# EAGLE design PosilaciSystemy (EAGLE 5.06)
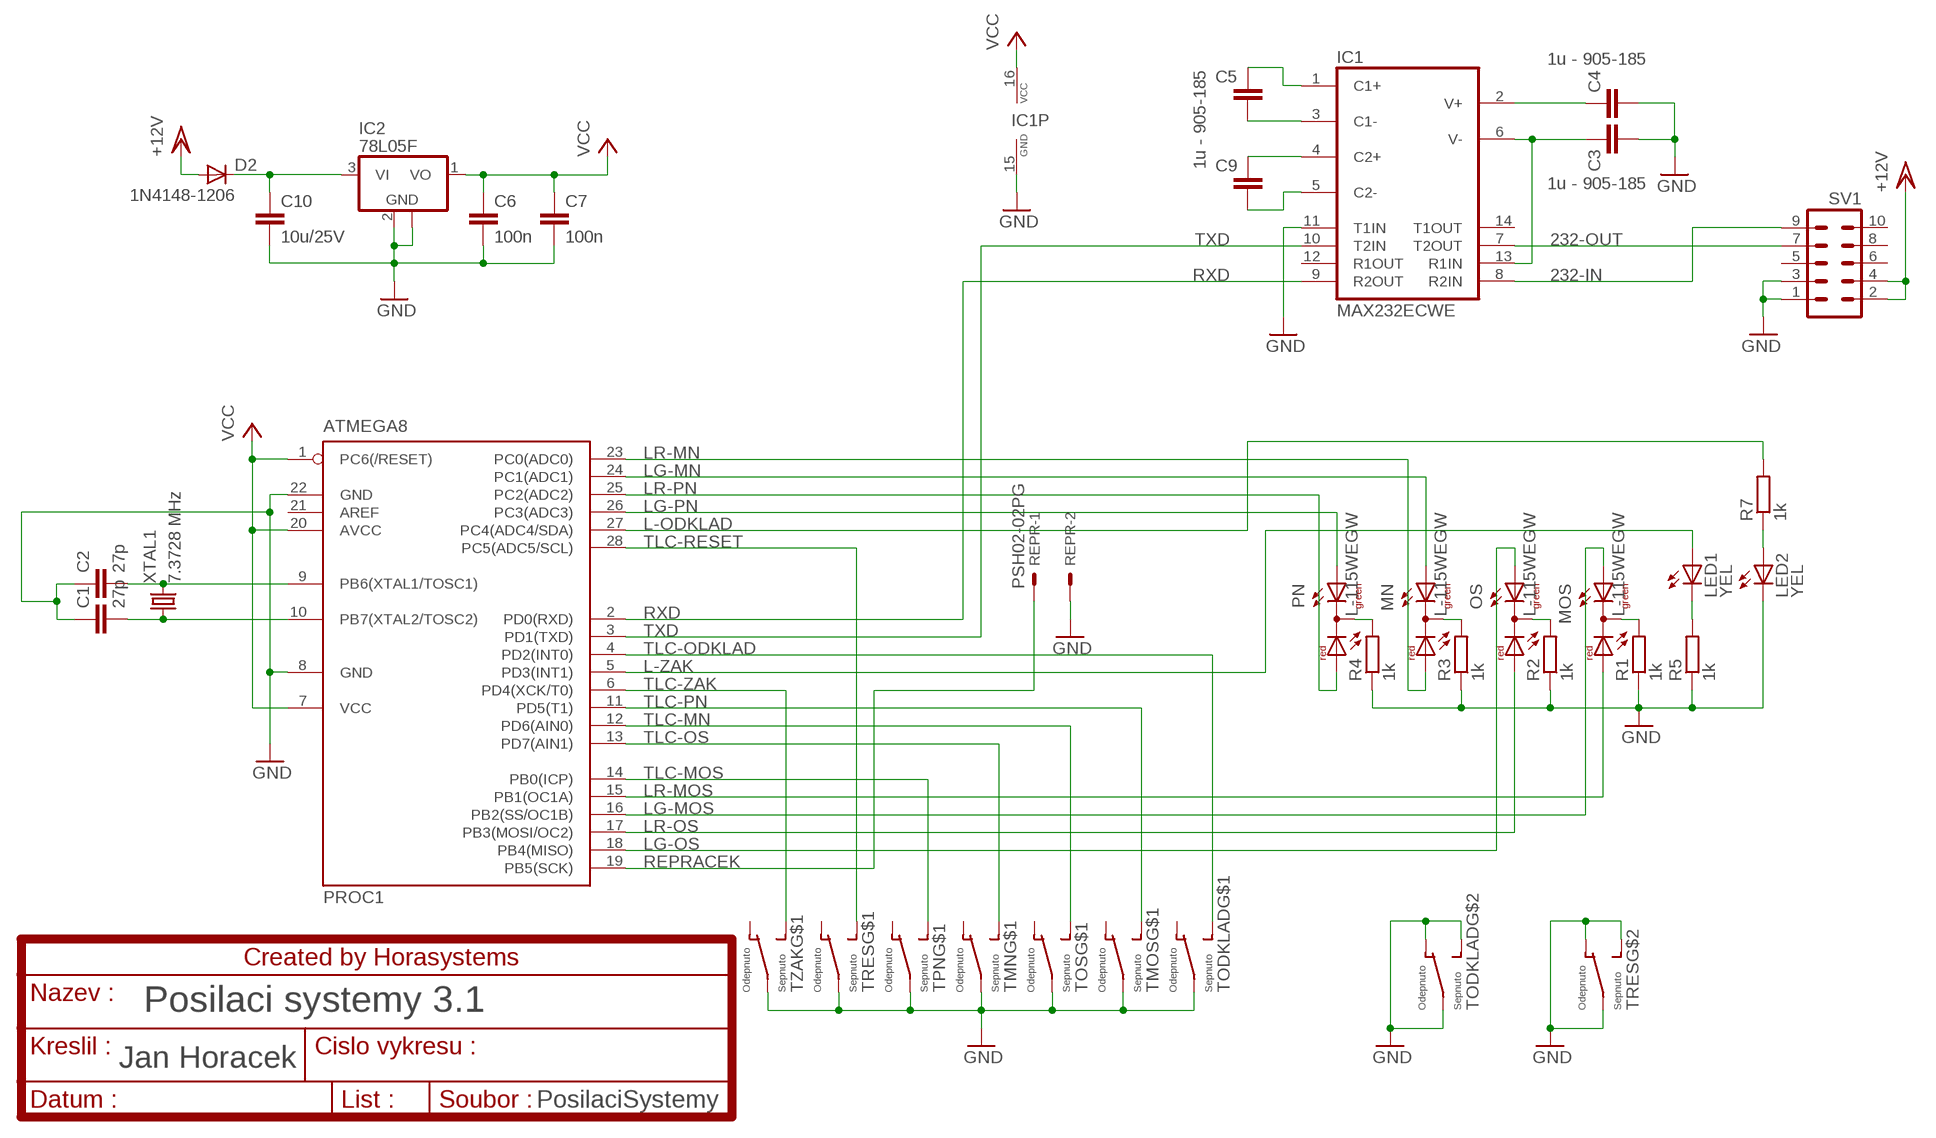
[diagram p0: schematic, sheet 1]

## Parts
C1  27p  C-EUC0805  [C0805]
C2  27p  C-EUC0805  [C0805]
C3  1u - 905-185  C-EUC0805  [C0805]
C4  1u - 905-185  C-EUC0805  [C0805]
C5  1u - 905-185  C-EUC0805  [C0805]
C6  100n  C-EUC1206  [C1206]
C7  100n  C-EUC1206  [C1206]
C9  1u - 905-185  C-EUC0805  [C0805]
C10  10u/25V  C-EUC1206  [C1206]
D2  1N4148-1206  [R1206]
IC1  MAX232ECWE  [SO16L]
IC2  78L05F  [SOT89]
LED1  YEL  LED3MM  [LED3MM]
LED2  YEL  LED3MM  [LED3MM]
MN  L-115WEGW  DUOLED-RG-C  [DUOLED-C-5MM]
MOS  L-115WEGW  DUOLED-RG-C  [DUOLED-C-5MM]
OS  L-115WEGW  DUOLED-RG-C  [DUOLED-C-5MM]
PN  L-115WEGW  DUOLED-RG-C  [DUOLED-C-5MM]
PROC1  ATMEGA8  MEGA8-P  [DIL28-3]
R1  1k  R-EU_R1206  [R1206]
R2  1k  R-EU_R1206  [R1206]
R3  1k  R-EU_R1206  [R1206]
R4  1k  R-EU_R1206  [R1206]
R5  1k  R-EU_R1206  [R1206]
R7  1k  R-EU_R1206  [R1206]
REPR  PSH02-02PG  22-05-7028-02  [7395-02]
SV1  ML10L  [ML10L]
TMN  P-B170H  HORASPINAC  [HORASPINAC]
TMOS  P-B170H  HORASPINAC  [HORASPINAC]
TODKLAD  P-B170H  HORASPINAC  [HORASPINAC]
TOS  P-B170H  HORASPINAC  [HORASPINAC]
TPN  P-B170H  HORASPINAC  [HORASPINAC]
TRES  P-B170H  HORASPINAC  [HORASPINAC]
TZAK  P-B170H  HORASPINAC  [HORASPINAC]
XTAL1  7.3728 MHz  CRYSTALHC49S  [HC49/S]

## Nets
232-IN: IC1.8(R2IN) SV1.9
232-OUT: IC1.7(T2OUT) SV1.7
GND: C1.1 C2.1 C3.2 C4.2 C6.2 C7.2 C10.2 IC1.11(T1IN) IC1.15(GND) IC2.2(GND) IC2.2@1(GND) LED2.K(C) PROC1.8(GND) PROC1.22(GND) R1.1 R2.1 R3.1 R4.1 R5.1 REPR.2 SV1.1 SV1.3 TMN.NAPAJENI1(NAPAJENI) TMOS.NAPAJENI1(NAPAJENI) TODKLAD.NAPAJENI1(NAPAJENI) TODKLAD.NAPAJENI2(NAPAJENI) TODKLAD.ODEPNUTO2(ODEPNUTO) TODKLAD.SEPNUTO2(SEPNUTO) TOS.NAPAJENI1(NAPAJENI) TPN.NAPAJENI1(NAPAJENI) TRES.NAPAJENI1(NAPAJENI) TRES.NAPAJENI2(NAPAJENI) TRES.ODEPNUTO2(ODEPNUTO) TRES.SEPNUTO2(SEPNUTO) TZAK.NAPAJENI1(NAPAJENI)
L3: MN.C R3.2
L4: PN.C R4.2
L-ODKLAD: PROC1.27(PC4(ADC4/SDA)) R7.2
L-ZAK: LED1.A PROC1.5(PD3(INT1))
LG-MN: MN.AX(AG) PROC1.24(PC1(ADC1))
LG-MOS: MOS.AX(AG) PROC1.16(PB2(SS/OC1B))
LG-OS: OS.AX(AG) PROC1.18(PB4(MISO))
LG-PN: PN.AX(AG) PROC1.26(PC3(ADC3))
LR-MN: MN.AR PROC1.23(PC0(ADC0))
LR-MOS: MOS.AR PROC1.15(PB1(OC1A))
LR-OS: OS.AR PROC1.17(PB3(MOSI/OC2))
LR-PN: PN.AR PROC1.25(PC2(ADC2))
N$5: LED1.K(C) R5.2
N$6: LED2.A R7.1
N$7: C5.1 IC1.1(C1+)
N$8: C5.2 IC1.3(C1-)
N$9: C9.1 IC1.4(C2+)
N$10: C10.1 D2.K(C) IC2.3(VI)
N$11: C9.2 IC1.5(C2-)
N$12: C3.1 IC1.6(V-) IC1.13(R1IN)
N$13: C4.1 IC1.2(V+)
N$14: OS.C R2.2
N$15: MOS.C R1.2
REPRACEK: PROC1.19(PB5(SCK)) REPR.1
RXD: IC1.9(R2OUT) PROC1.2(PD0(RXD))
TLC-MN: PROC1.12(PD6(AIN0)) TOS.SEPNUTO1(SEPNUTO)
TLC-MOS: PROC1.14(PB0(ICP)) TPN.SEPNUTO1(SEPNUTO)
TLC-ODKLAD: PROC1.4(PD2(INT0)) TODKLAD.SEPNUTO1(SEPNUTO)
TLC-OS: PROC1.13(PD7(AIN1)) TMN.SEPNUTO1(SEPNUTO)
TLC-PN: PROC1.11(PD5(T1)) TMOS.SEPNUTO1(SEPNUTO)
TLC-RESET: PROC1.28(PC5(ADC5/SCL)) TRES.SEPNUTO1(SEPNUTO)
TLC-ZAK: PROC1.6(PD4(XCK/T0)) TZAK.SEPNUTO1(SEPNUTO)
TXD: IC1.10(T2IN) PROC1.3(PD1(TXD))
VCC: C6.1 C7.1 IC1.16(VCC) IC2.1(VO) PROC1.1(PC6(/RESET)) PROC1.7(VCC) PROC1.20(AVCC)
VCC/2: D2.A SV1.2 SV1.4 ; supply symbol labelled +12V
XTAL1: C2.2 PROC1.9(PB6(XTAL1/TOSC1)) XTAL1.2
XTAL2: C1.2 PROC1.10(PB7(XTAL2/TOSC2)) XTAL1.1
Unconnected: IC1.12(R1OUT) IC1.14(T1OUT) PROC1.21(AREF) SV1.5 SV1.6 SV1.8 SV1.10 TMN.NAPAJENI2(NAPAJENI) TMN.ODEPNUTO1(ODEPNUTO) TMN.ODEPNUTO2(ODEPNUTO) TMN.SEPNUTO2(SEPNUTO) TMOS.NAPAJENI2(NAPAJENI) TMOS.ODEPNUTO1(ODEPNUTO) TMOS.ODEPNUTO2(ODEPNUTO) TMOS.SEPNUTO2(SEPNUTO) TODKLAD.ODEPNUTO1(ODEPNUTO) TOS.NAPAJENI2(NAPAJENI) TOS.ODEPNUTO1(ODEPNUTO) TOS.ODEPNUTO2(ODEPNUTO) TOS.SEPNUTO2(SEPNUTO) TPN.NAPAJENI2(NAPAJENI) TPN.ODEPNUTO1(ODEPNUTO) TPN.ODEPNUTO2(ODEPNUTO) TPN.SEPNUTO2(SEPNUTO) TRES.ODEPNUTO1(ODEPNUTO) TZAK.NAPAJENI2(NAPAJENI) TZAK.ODEPNUTO1(ODEPNUTO) TZAK.ODEPNUTO2(ODEPNUTO) TZAK.SEPNUTO2(SEPNUTO)

## Notes on the sheet
- Posilaci systemy 3.1

## Library data of the parts
C1-C7 C9 C10 = rcl:C-EU: CAPACITOR, European symbol
D2 = diode:1N4148: DIODE high speed (Philips)
IC1 = maxim:MAX232ECWE: RS232 TRANSEIVER
IC2 = linear:78L*: POSITOIV-VOLTAGE REGULATORS Output up to 100 mA Source: http://focus.ti.com/lit/ds/symlink/ua78l05.pdf
LED1 LED2 = led:LED: LED OSRAM: - CHIPLED LG R971, LG N971, LY N971, LG Q971, LY Q971, LO R971, LY R971 LH N974, LH R974 LS Q976, LO Q976, LY Q976 LO Q996 - Hyper CHIPLED LW Q18S LB Q993, LB Q99A, LB R99A - SideLED LS A670, LO A670, LY A670, LG A670, LP A670 LB A673, LV A673, LT A673, LW A673 LH A674 LY A675 LS A676, LA A676, LO A676, LY A676, LW A676 LS A679, LY A679, LG A679 - Hyper Micro SIDELED® LS Y876, LA Y876, LO Y876, LY Y876 LT Y87S - SmartLED LW L88C, LW L88S LB L89C, LB L89S, LG L890 LS L89K, LO L89K, LY L89K LS L896, LA L896, LO L896, LY L896 - TOPLED LS T670, LO T670, LY T670, LG T670, LP T670 LSG T670, LSP T670, LSY T670, LOP T670, LYG T670 LG T671, LOG T671, LSG T671 LB T673, LV T673, LT T673, LW T673 LH T674 LS T676, LA T676, LO T676, LY T676, LB T676, LH T676, LSB T676, LW T676 LB T67C, LV T67C, LT T67C, LS T67K, LO T67K, LY T67K, LW E67C LS E67B, LA E67B, LO E67B, LY E67B, LB E67C, LV E67C, LT E67C LW T67C LS T679, LY T679, LG T679 LS T770, LO T770, LY T770, LG T770, LP T770 LB T773, LV T773, LT T773, LW T773 LH T774 LS E675, LA E675, LY E675, LS T675 LS T776, LA T776, LO T776, LY T776, LB T776 LHGB T686 LT T68C, LB T68C - Hyper Mini TOPLED® LB M676 - Mini TOPLED Santana® LG M470 LS M47K, LO M47K, LY M47K Source: http://www.osram.convergy.de LUXEON: - LUMILED® LXK2-PW12-R00, LXK2-PW12-S00, LXK2-PW14-U00, LXK2-PW14-V00 LXK2-PM12-R00, LXK2-PM12-S00, LXK2-PM14-U00 LXK2-PE12-Q00, LXK2-PE12-R00, LXK2-PE12-S00, LXK2-PE14-T00, LXK2-PE14-U00 LXK2-PB12-K00, LXK2-PB12-L00, LXK2-PB12-M00, LXK2-PB14-N00, LXK2-PB14-P00, LXK2-PB14-Q00 LXK2-PR12-L00, LXK2-PR12-M00, LXK2-PR14-Q00, LXK2-PR14-R00 LXK2-PD12-Q00, LXK2-PD12-R00, LXK2-PD12-S00 LXK2-PH12-R00, LXK2-PH12-S00 LXK2-PL12-P00, LXK2-PL12-Q00, LXK2-PL12-R00 Source: www.luxeon.com KINGBRIGHT: KA-3528ASYC Source: www.kingbright.com
MN MOS OS PN = led:DUOLED-RG-C: DUO LED 2 colors (red/green), 5 mm, round, common Cathode www.ligitek.com or other producers.
PROC1 = atmel:MEGA8-P: MICROCONTROLLER 8 Kbytes FLASH, 1 kbytes SRAM, 512 bytes EEPROM, USART, 4-channel 10 bit ADC, 2-channel 8 bit ADC Pin compatible with Atmega48, ATMega88, ATMega168 Source: avr.lbr
R1-R5 R7 = rcl:R-EU_: RESISTOR, European symbol
REPR = con-molex:22-?-02: CONNECTOR wire to board 2.54 mm (.1 inch) pitch header
SV1 = con-harting-ml:ML10: HARTING
TMN TMOS TODKLAD TOS TPN TRES TZAK = switch:HORASPINAC
XTAL1 = crystal:CRYSTAL: CRYSTAL

## Board
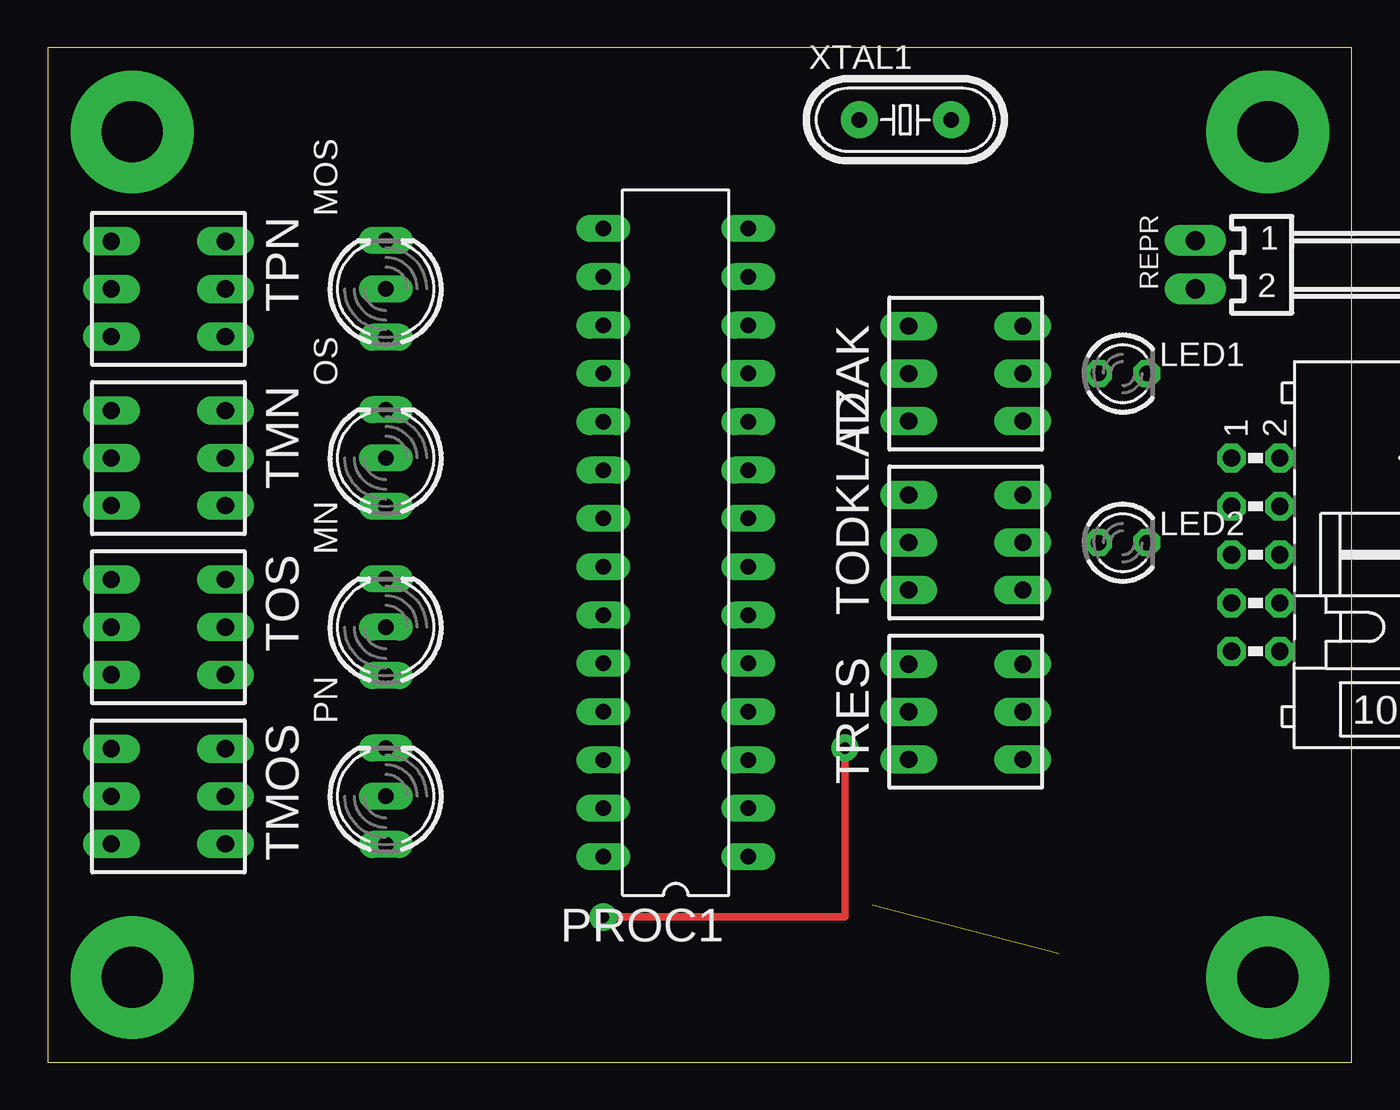
[diagram p1: board, top side]
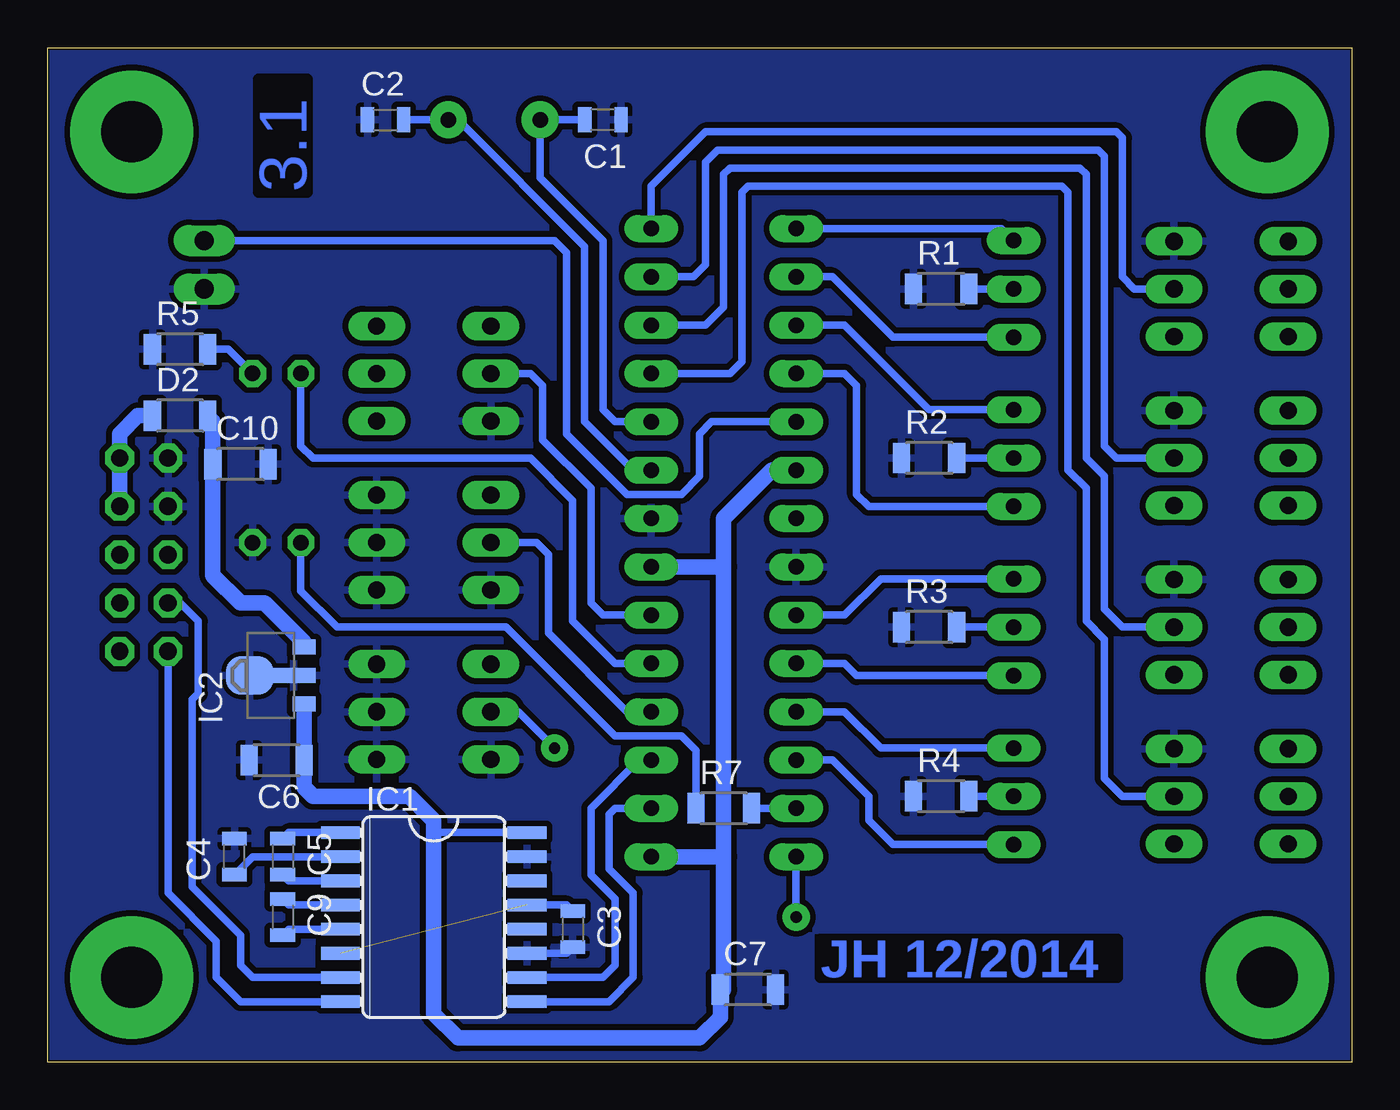
[diagram p2: board, bottom side, seen from below]

Size 68.56 x 53.33 mm. Coordinates in mm from the lower left corner, seen from the top.
Outline: 0,0 68.56,0 68.56,53.33 0,53.33 0,0
Copper layers (1*16): Top 0.036mm / dielectric 1.5011mm / Bottom 0.0356mm
Design rules "EBT_fotocesta_H": minimum track width 0.3mm, minimum drill 0.6mm, track to track 0.3mm, track to pad 0.3mm, pad to pad 0.2mm, via to via 0.2mm, smd to smd 0mil, copper to edge 0.1mm, drill to drill 0.5mm, minimum pad ring 0.3mm, minimum via ring 0.4mm, stop-mask expansion 0mil, vias tented up to drill 0mil, thermal gap 10mil

### Footprints (pad centres in the part's own frame; a part is rotated, then mirrored left to right if it is on the bottom)
C0805 = smd 0.7 x 1.3: 1 -0.95,0; 2 0.95,0
C1206 = smd 0.9 x 1.6: 1 -1.45,0; 2 1.45,0
R1206 = smd 0.9 x 1.6: A -1.45,0; K 1.45,0
SO16L = smd 0.66 x 2.032: 1 -4.445,-4.902; 2 -3.175,-4.902; 3 -1.905,-4.902; 4 -0.635,-4.902; 5 0.635,-4.902; 6 1.905,-4.902; 7 3.175,-4.902; 8 4.445,-4.902; 9 4.445,4.902; 10 3.175,4.902; 11 1.905,4.902; 12 0.635,4.902; 13 -0.635,4.902; 14 -1.905,4.902; 15 -3.175,4.902; 16 -4.445,4.902
SOT89 = smd 0.8 x 1.2: 1 -1.5,-1.75; 3 1.499,-1.75 | smd 0.8 x 2.3: 2 0,-1.2 | smd 2 x 2.5: 2@1 0,1.1
LED3MM = drill 0.813 octagon: A -1.27,0; K 1.27,0
DUOLED-C-5MM = drill 0.813 long: AR 2.54,0; AX -2.54,0; C 0,0
DIL28-3 = drill 0.813 long: 1 -16.51,-3.81; 2 -13.97,-3.81; 3 -11.43,-3.81; 4 -8.89,-3.81; 5 -6.35,-3.81; 6 -3.81,-3.81; 7 -1.27,-3.81; 8 1.27,-3.81; 9 3.81,-3.81; 10 6.35,-3.81; 11 8.89,-3.81; 12 11.43,-3.81; 13 13.97,-3.81; 14 16.51,-3.81; 15 16.51,3.81; 16 13.97,3.81; 17 11.43,3.81; 18 8.89,3.81; 19 6.35,3.81; 20 3.81,3.81; 21 1.27,3.81; 22 -1.27,3.81; 23 -3.81,3.81; 24 -6.35,3.81; 25 -8.89,3.81; 26 -11.43,3.81; 27 -13.97,3.81; 28 -16.51,3.81
R1206' = smd 0.9 x 1.6: 1 -1.45,0; 2 1.45,0
7395-02 = drill 1.016 long: 1 1.27,0; 2 -1.27,0
ML10L = drill 0.914 octagon: 1 -5.08,-1.27; 2 -5.08,1.27; 3 -2.54,-1.27; 4 -2.54,1.27; 5 0,-1.27; 6 0,1.27; 7 2.54,-1.27; 8 2.54,1.27; 9 5.08,-1.27; 10 5.08,1.27
HORASPINAC = drill 0.9 pad 1.422 long: NAPAJENI1 -2.5,3; NAPAJENI2 2.5,-3; ODEPNUTO1 2.5,3; ODEPNUTO2 -2.5,-3; SEPNUTO1 0,3; SEPNUTO2 0,-3
HC49/S = drill 0.813 pad 1.93: 1 -2.413,0; 2 2.413,0

### Placement (x,y rotation side)
C1  39.37,49.53 180 bottom
C2  50.8,49.53 0 bottom
C3  40.96,6.99 270 bottom
C4  58.74,10.79 90 bottom
C5  56.2,10.79 270 bottom
C6  56.52,15.88 180 bottom
C7  31.75,3.81 0 bottom
C9  56.2,7.62 270 bottom
C10  58.42,31.43 0 bottom
D2  61.59,33.97 0 bottom
IC1  48.26,7.62 270 bottom
IC2  56.83,20.32 90 bottom
LED1  56.52,36.2 0 top
LED2  56.52,27.3 0 top
MN  17.78,22.86 90 top
MOS  17.78,40.64 90 top
OS  17.78,31.75 90 top
PN  17.78,13.97 90 top
PROC1  33.02,27.3 90 top
R1  1k  [R1206']  21.59,40.64 0 bottom
R2  1k  [R1206']  22.23,31.75 0 bottom
R3  1k  [R1206']  22.23,22.86 0 bottom
R4  1k  [R1206']  21.59,13.97 0 bottom
R5  1k  [R1206']  61.59,37.47 0 bottom
R7  1k  [R1206']  33.02,13.34 0 bottom
REPR  60.33,41.91 90 top
SV1  63.5,26.67 270 top
TMN  6.35,31.75 270 top
TMOS  6.35,13.97 270 top
TODKLAD  48.26,27.3 90 top
TOS  6.35,22.86 270 top
TPN  6.35,40.64 270 top
TRES  48.26,18.41 90 top
TZAK  48.26,36.2 90 top
XTAL1  45.09,49.53 0 top

### Tracks (layer width: path | path; a pad name or v marks a point on that pad's centre or on a via)
232-IN
  Bottom 0.406: IC1.8 58.42,3.17 59.69,4.45 59.69,6.35 62.23,8.89 SV1.9
232-OUT
  Bottom 0.406: IC1.7 57.78,4.45 58.42,5.08 58.42,6.67 60.96,9.21 60.96,19.05 60.64,19.37 60.64,23.18 61.59,24.13 SV1.7
GND
  Bottom 0.406: IC1.11 41.28,5.71 C3.2
  pour Bottom: 0,0 0,53.34 68.58,53.34 68.58,0
L3
  Bottom 0.406: MN.C R3.2
L4
  Bottom 0.406: PN.C R4.2
L-ODKLAD
  Bottom 0.406: PROC1.27 R7.2
L-ZAK
  Bottom 0.406: LED1.A 55.24,32.38 54.61,31.75 43.18,31.75 40.96,29.53 40.96,23.18 38.73,20.95 PROC1.5
LG-MN
  Bottom 0.406: PROC1.24 26.67,20.95 26.04,20.32 MN.AX
LG-MOS
  Bottom 0.406: MOS.AX 24.13,38.1 27.3,41.27 PROC1.16
LG-OS
  Bottom 0.406: PROC1.18 26.67,36.2 26.04,35.56 26.04,29.84 25.4,29.21 OS.AX
LG-PN
  Bottom 0.406: PROC1.26 27.3,15.88 25.4,13.97 25.4,12.7 24.13,11.43 PN.AX
LR-MN
  Bottom 0.406: MN.AR 24.77,25.4 26.67,23.5 PROC1.23
LR-MOS
  Bottom 0.406: PROC1.15 18.41,43.81 MOS.AR
LR-OS
  Bottom 0.406: OS.AR 22.23,34.29 26.67,38.73 PROC1.17
LR-PN
  Bottom 0.406: PROC1.25 26.67,18.41 24.77,16.51 PN.AR
N$1  (via drill 3.2 pad 6.45)
  other vias: 4.45,4.45
N$2  (via drill 3.2 pad 6.45)
  other vias: 4.45,48.9
N$3  (via drill 3.2 pad 6.45)
  other vias: 64.14,48.9
N$4  (via drill 3.2 pad 6.45)
  other vias: 64.14,4.45
N$5
  Bottom 0.406: R5.2 59.05,37.47 LED1.K
N$6
  Bottom 0.406: R7.1 34.47,16.37 35.24,17.14 38.73,17.14 44.45,22.86 53.34,22.86 55.24,24.77 LED2.A
N$7
  Bottom 0.406: IC1.1 55.88,12.06 C5.1
N$8
  Bottom 0.406: IC1.3 55.88,9.53 C5.2
N$9
  Bottom 0.406: IC1.4 55.88,8.26 C9.1
N$10
  Bottom 0.813: D2.K 59.87,33.7 C10.1 59.87,25.58 58.42,24.13 57.15,24.13 55.08,22.06 IC2.3
N$11
  Bottom 0.406: IC1.5 55.88,6.99 C9.2
N$12  (1 unrouted)
  Bottom 0.406: IC1.13 41.28,8.26 C3.1
N$13
  Bottom 0.406: IC1.2 57.79,10.79 C4.1
N$14
  Bottom 0.406: OS.C R2.2
N$15
  Bottom 0.406: R1.2 MOS.C
REPRACEK
  Bottom 0.406: REPR.1 41.91,43.18 41.27,42.55 41.27,33.02 38.1,29.84 35.24,29.84 34.29,30.8 34.29,33.02 33.66,33.66 PROC1.19
RXD
  Bottom 0.406: PROC1.2 38.73,13.34 39.05,13.02 39.05,10.16 37.78,8.89 37.78,4.45 39.05,3.17 IC1.9
TLC-MN
  Bottom 0.406: PROC1.12 33.97,38.73 33.02,39.69 33.02,46.67 32.7,46.99 14.29,46.99 13.97,46.67 13.97,31.75 13.02,30.8 13.02,23.81 12.06,22.86 TOS.SEPNUTO1
TLC-MOS
  Bottom 0.406: PROC1.14 36.83,46.04 33.97,48.9 12.38,48.9 12.06,48.58 12.06,41.27 11.43,40.64 TPN.SEPNUTO1
TLC-ODKLAD
  Bottom 0.406: TODKLAD.SEPNUTO1 42.86,27.3 42.23,26.67 42.23,22.54 38.1,18.41 PROC1.4
TLC-OS
  Bottom 0.406: PROC1.13 34.61,41.27 33.97,41.91 33.97,47.31 33.34,47.94 13.34,47.94 13.02,47.62 13.02,32.38 12.38,31.75 TMN.SEPNUTO1
TLC-PN
  Bottom 0.406: PROC1.11 32.7,36.2 32.07,36.83 32.07,45.72 31.75,46.04 15.24,46.04 14.92,45.72 14.92,31.11 13.97,30.16 13.97,23.18 13.02,22.23 13.02,14.92 12.06,13.97 TMOS.SEPNUTO1
TLC-RESET  (via drill 0.6 pad 1.42)
  Top 0.406: v41.91,16.51 41.91,7.62 v29.21,7.62
  Bottom 0.406: TRES.SEPNUTO1 43.81,18.41 v41.91,16.51 | v29.21,7.62 PROC1.28
TLC-ZAK
  Bottom 0.406: TZAK.SEPNUTO1 43.18,36.2 42.55,35.56 42.55,32.7 40.01,30.16 40.01,24.13 39.37,23.5 PROC1.6
TXD
  Bottom 0.406: IC1.10 39.37,4.45 38.73,5.08 38.73,8.57 40.01,9.84 40.01,13.34 37.47,15.88 PROC1.3
VCC
  Bottom 0.406: 48.26,12.06 IC1.16
  Bottom 0.813: 33.02,26.04 PROC1.7 | PROC1.20 30.48,31.11 33.02,28.57 33.02,26.04 | 33.02,10.79 PROC1.1 | 33.02,10.79 33.02,26.04 | 33.02,10.79 33.02,3.81 C7.1 33.2,2.36 34.29,1.27 46.99,1.27 48.26,2.54 48.26,12.06 48.26,12.7 49.53,13.97 54.61,13.97 55.06,14.43 C6.1 55.06,18.8 IC2.1
VCC/2
  Bottom 0.813: SV1.4 SV1.2 64.77,33.02 63.82,33.97 D2.A
XTAL1
  Bottom 0.406: C2.2 XTAL1.2 46.99,49.53 40.32,42.86 40.32,33.66 37.78,31.11 PROC1.9
XTAL2
  Bottom 0.406: PROC1.10 38.73,33.66 39.37,34.29 39.37,43.18 42.67,46.48 XTAL1.1 C1.2

### Text on the board
Bottom: 3.1 | JH 12/2014
Popisky: 7 | MOs | 7 | ZAK | 7 | Os | 7 | Odklad | 7 | Mn | 7 | Zrusit | 7 | Pn